# EAGLE design nas_control_v1 (EAGLE 9.7.0)
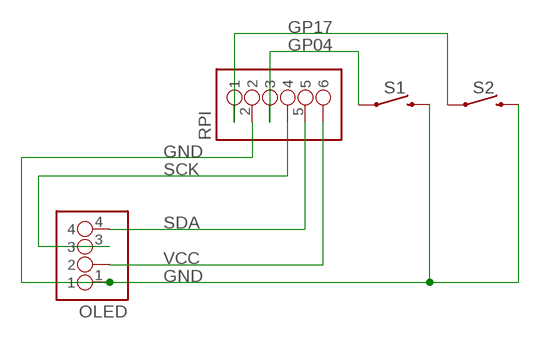
[diagram p0: schematic, sheet 1]

## Parts
OLED  PINHD-1X04_1X04M  [1X04]
RPI  PINHD-1X06_1X06M  [1X06]
S1  MOMENTARY-SWITCH-SPST-PTH-6.0MM  [TACTILE_SWITCH_PTH_6.0MM]
S2  MOMENTARY-SWITCH-SPST-PTH-6.0MM  [TACTILE_SWITCH_PTH_6.0MM]

## Nets
GND: OLED.1 RPI.2 S1.3 S2.3
GP04: RPI.3 S1.1
GP17: RPI.1 S2.1
SCK: OLED.3 RPI.4
SDA: OLED.4 RPI.5
VCC: OLED.2 RPI.6

## Library data of the parts
OLED = Tinkercad:PINHD-1X04
RPI = Tinkercad:PINHD-1X06
S1 S2 = SparkFun-Switches:MOMENTARY-SWITCH-SPST: Momentary Switch (Pushbutton) - SPST Normally-open (NO) SPST momentary switches (buttons, pushbuttons). Variants PTH-12MM - 12mm square, through-hole Momentary Pushbutton Switch - 12mm Square <https://www.sparkfun.com/products/9190> (COM-09190) PTH-6.0MM, PTH-6.0MM-KIT - 6.0mm square, through-hole Mini Pushbutton Switch <https://www.sparkfun.com/products/97> (COM-00097) KIT package intended for soldering kit's - only one side of pads' copper is exposed. PTH-RIGHT-ANGLE-KIT - Right-angle, through-hole Right Angle Tactile Button <https://www.sparkfun.com/products/10791> - Used on SparkFun BigTime Watch Kit <https://www.sparkfun.com/products/11734> SMD-12MM - 12mm square, surface-mount Tactile Button - SMD (12mm) <https://www.sparkfun.com/products/12993> (COM-12993) Used on SparkFun PicoBoard <https://www.sparkfun.com/products/11888> SMD-4.5MM - 4.5mm Square Trackball Switch Used on SparkFun Blackberry Trackballer Breakout <https://www.sparkfun.com/products/13169> SMD-4.6MMX2.8MM - 4.60mm x 2.80mm, surface mount Used on SparkFun Pro Micro - RP2040 <https://www.sparkfun.com/products/17717> SMD-5.2MM, SMD-5.2-REDUNDANT - 5.2mm square, surface-mount Mini Pushbutton Switch - SMD <https://www.sparkfun.com/products/8720> (COM-08720) Used on Arduino Pro Mini <https://www.sparkfun.com/products/11114> REDUNDANT package connects both switch circuits together SMD-6.0X3.5MM - 6.0 x 3.5mm, surface mount Momentary Reset Switch SMD <https://www.sparkfun.com/products/8229> (COM-08229) SMD-6.2MM-TALL - 6.2mm square, surface mount Tactile Button - SMD (6mm) <https://www.sparkfun.com/products/12992> Used on SparkFun Digital Sandbox <https://www.sparkfun.com/products/12651> SMD-RIGHT-ANGLE - Right-angle, surface mount Used on SparkFun Block for Intel® Edison - Arduino <https://www.sparkfun.com/products/13036>; PROD_ID: SWCH-08441; SF_SKU: COM-00097

## Board
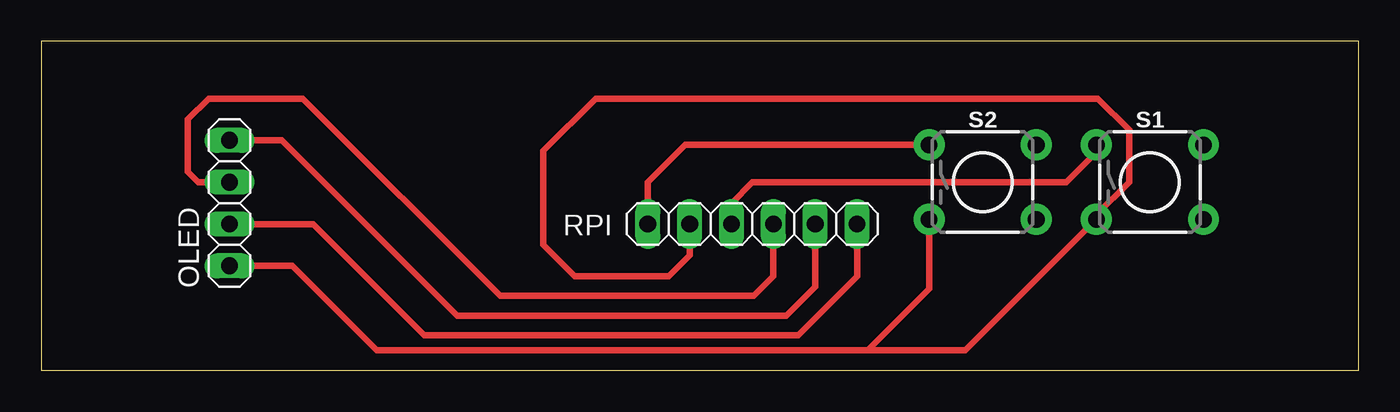
[diagram p1: board, top side]

Size 79.99 x 19.99 mm. Coordinates in mm from the lower left corner, seen from the top.
Outline: 0,0 79.99,0 79.99,19.99 0,19.99 0,0
Copper layers (1*16): Top 0.035mm / dielectric 1.5mm / Bottom 0.035mm
Design rules "Fusion Electronics Design Rules": minimum track width 6mil, minimum drill 0.35mm, track to track 6mil, track to pad 6mil, pad to pad 6mil, via to via 6mil, smd to smd 6mil, copper to edge 40mil, drill to drill 6mil, minimum pad ring 10mil, minimum via ring 8mil, stop-mask expansion 4mil, vias tented up to drill 9999mil, thermal gap 10mil

### Footprints (pad centres in the part's own frame; a part is rotated, then mirrored left to right if it is on the bottom)
1X04 = drill 1.016 long: 1 -3.81,0; 2 -1.27,0; 3 1.27,0; 4 3.81,0
1X06 = drill 1.016 long: 1 -6.35,0; 2 -3.81,0; 3 -1.27,0; 4 1.27,0; 5 3.81,0; 6 6.35,0
TACTILE_SWITCH_PTH_6.0MM = drill 1.016 pad 1.88: 1 -3.251,2.261; 2 3.251,2.261; 3 -3.251,-2.261; 4 3.251,-2.261

### Placement (x,y rotation side)
OLED  11.43,10.16 90 top
RPI  43.18,8.89 0 top
S1  67.31,11.43 0 top
S2  57.15,11.43 0 top

### Tracks (layer width: path | path; a pad name or v marks a point on that pad's centre or on a via)
GND
  Top 0.406: RPI.2 39.37,6.99 38.1,5.71 32.38,5.71 30.48,7.62 30.48,13.34 33.66,16.51 64.14,16.51 66.04,14.61 66.04,11.43 64.06,9.45 S1.3 56.11,1.22 50.16,1.22 | OLED.1 15.24,6.35 20.37,1.22 50.16,1.22 | S2.3 53.9,4.95 50.16,1.22
GP04
  Top 0.406: RPI.3 41.91,10.16 43.18,11.43 62.23,11.43 64.06,13.26 S1.1
GP17
  Top 0.406: RPI.1 36.83,11.43 39.09,13.69 S2.1
SCK
  Top 0.406: OLED.3 9.53,11.43 8.89,12.06 8.89,15.24 10.16,16.51 15.88,16.51 27.86,4.52 43.26,4.52 44.45,5.71 RPI.4
SDA
  Top 0.406: RPI.5 46.99,5.08 45.24,3.33 25.25,3.33 14.61,13.97 OLED.4
VCC
  Top 0.406: RPI.6 49.53,5.71 45.95,2.13 23.27,2.13 16.51,8.89 OLED.2